# Altium project STM32_Pi_HAT.PrjPcb
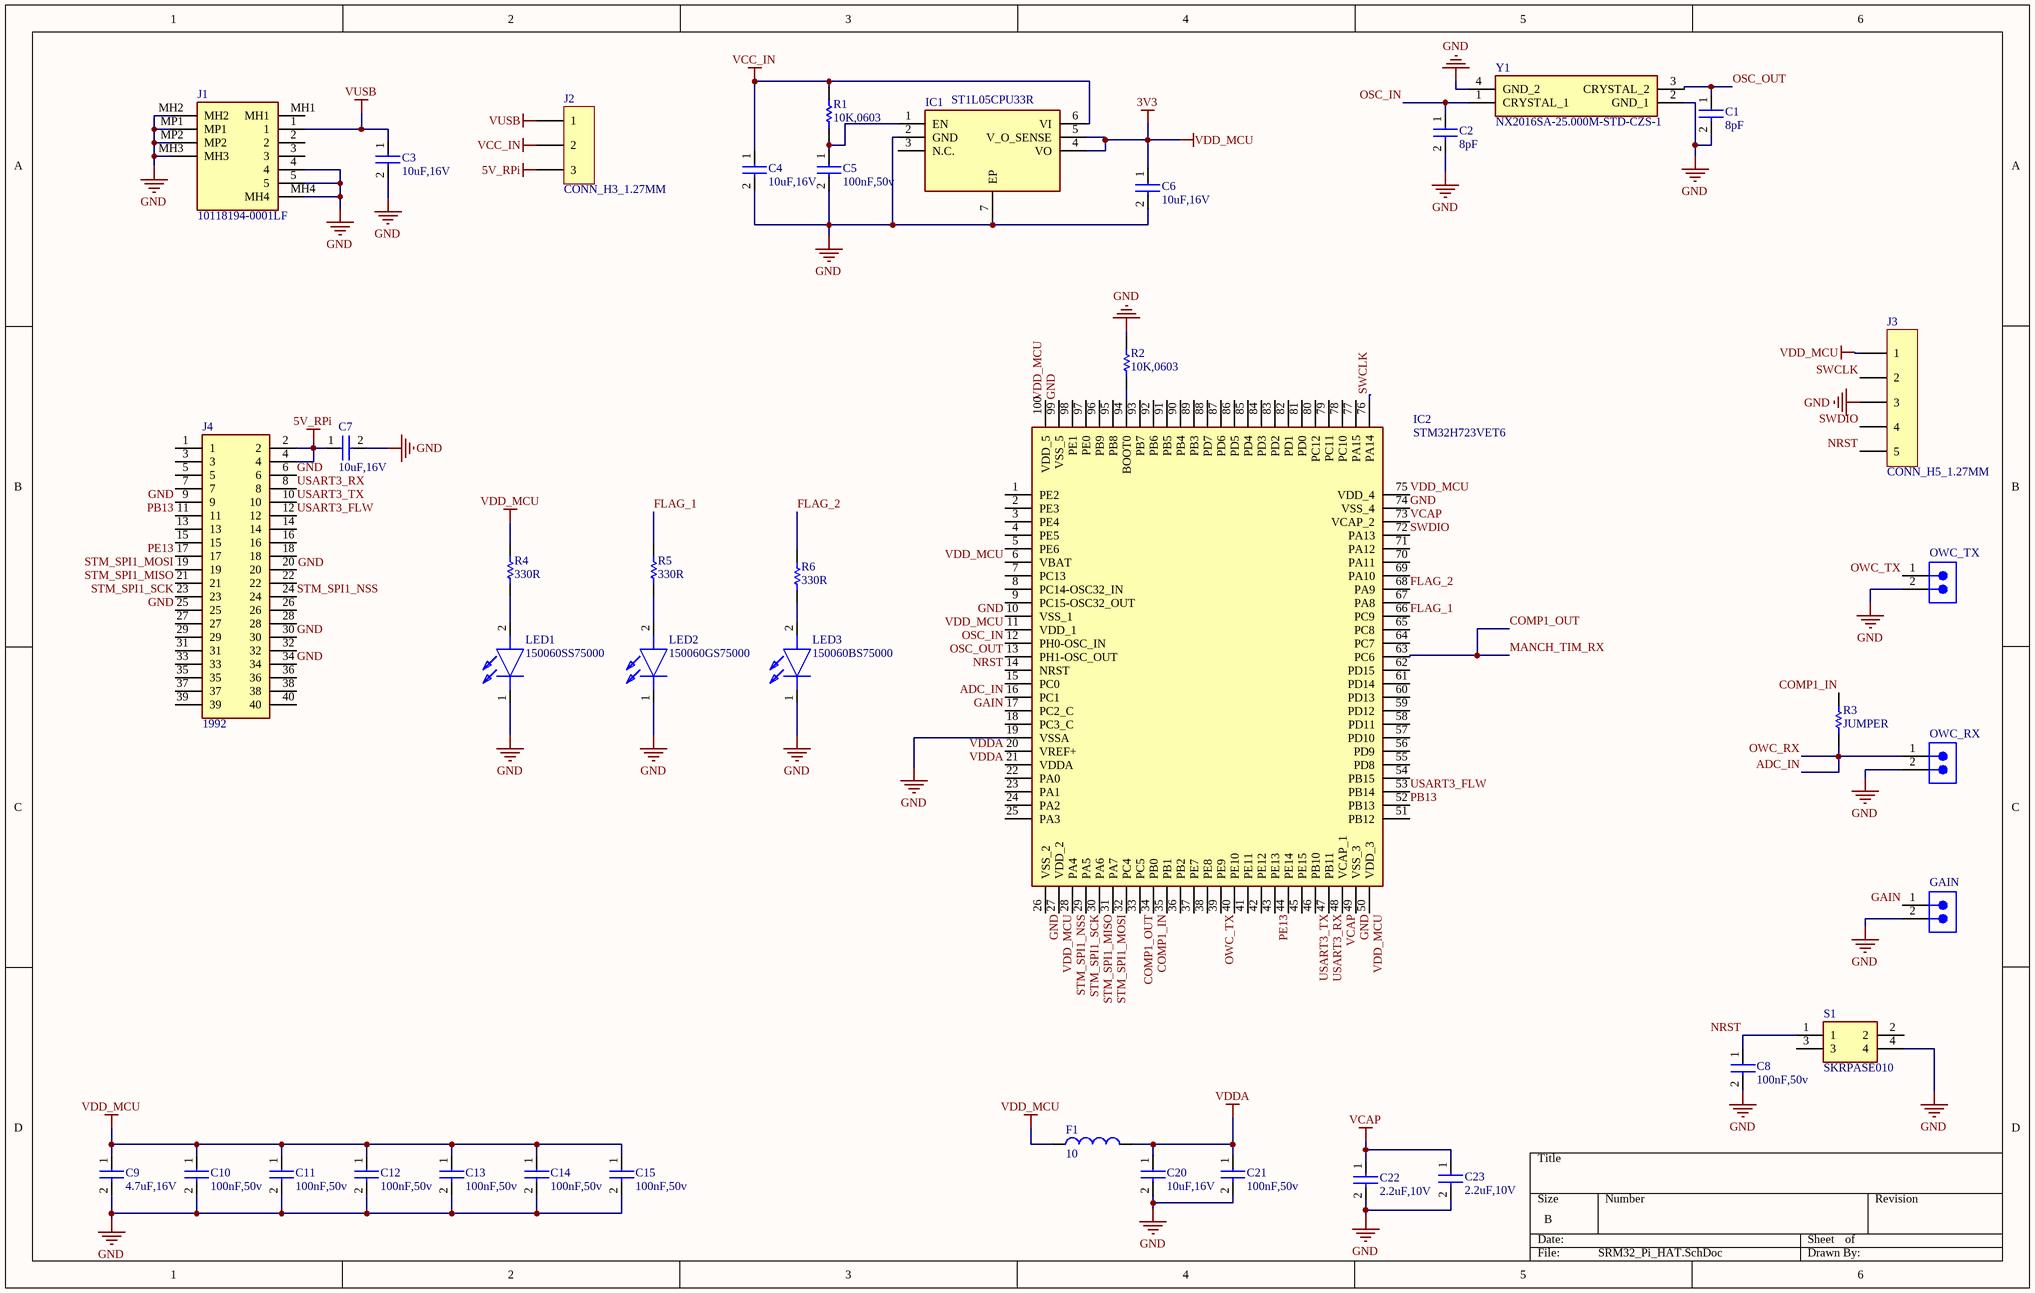
[diagram p0: SRM32_Pi_HAT.SchDoc]
1 sheet, 40 parts. Net scope: global (net labels, ports and power ports of the same name join across sheets).
Board file: STM32_Pi_HAT.PcbDoc

## Sheet SRM32_Pi_HAT.SchDoc: RPi_HAT_STM32
size B; CompanyName: IMDEA Networks; Revision: 1; SheetNumber: 1; SheetTotal: 1

### Parts
C1  8pF  [CAP0603_]
C2  8pF  [CAP0603_]
C3  10uF,16V  [CAP0603_]
C4  10uF,16V  [CAP0603_]
C5  100nF,50v  [CAP0603_]
C6  10uF,16V  [CAP0603_]
C7  10uF,16V  [CAP0603_]
C8  100nF,50v  [CAP0603_]
C9  4.7uF,16V  [CAP0603_]
C10  100nF,50v  [CAP0603_]
C11  100nF,50v  [CAP0603_]
C12  100nF,50v  [CAP0603_]
C13  100nF,50v  [CAP0603_]
C14  100nF,50v  [CAP0603_]
C15  100nF,50v  [CAP0603_]
C20  10uF,16V  [CAP0603_]
C21  100nF,50v  [CAP0603_]
C22  2.2uF,10V  [CAP0603_]
C23  2.2uF,10V  [CAP0603_]
F1  10  [IND0603_]
GAIN  61900211121  [61900211121]  (value not drawn)
IC1  ST1L05CPU33R  [SON95P300X300X100-7N-D]
IC2  STM32H723VET6  [QFP50P1600X1600X160-100N]
J1  10118194-0001LF  [101181940001LF]
J2  CONN_H3_1.27MM  [CONN_H3_1.27MM]
J3  CONN_H5_1.27MM  [CONN_H5_1.27MM]
J4  1992  [RHDR40W64P254_2X20_5130X500X1375P]
LED1  150060SS75000  [LEDC1608X80N]
LED2  150060GS75000  [LEDC1608X70N]
LED3  150060BS75000  [LEDC1608X80N]
OWC_RX  61900211121  [61900211121]  (value not drawn)
OWC_TX  61900211121  [61900211121]  (value not drawn)
R1  10K,0603  [RES0603_]
R2  10K,0603  [RES0603_]
R3  JUMPER  [RES0603_]
R4  330R  [RES0603_]
R5  330R  [RES0603_]
R6  330R  [RES0603_]
S1  SKRPASE010  [SKRPASE010]
Y1  NX2016SA-25.000M-STD-CZS-1  [NX2016SA32MEXS00ACS06465]

### Nets
5V_RPi: C7.1 J2.3 J4.2 J4.4
GND: C1.2 C2.2 C3.2 C4.2 C5.2 C6.2 C7.2 C8.2 C9.2 C10.2 C11.2 C12.2 C13.2 C14.2 C15.2 C20.2 C21.2 C22.2 C23.2 GAIN.2 IC1.2(GND) IC1.7(EP) IC2.10(VSS_1) IC2.19(VSSA) IC2.26(VSS_2) IC2.49(VSS_3) IC2.74(VSS_4) IC2.99(VSS_5) J1.4 J1.5 J1.MH2 J1.MH3 J1.MH4 J1.MP1 J1.MP2 J3.3 J4.6 J4.9 J4.25 J4.30 J4.34 LED1.1(K) LED2.1(K) LED3.1(K) OWC_RX.2 OWC_TX.2 R2.1 S1.4 Y1.2(GND_1) Y1.4(GND_2)
VCAP: C22.1 C23.1 IC2.48(VCAP_1) IC2.73(VCAP_2)
VCC_IN: C4.1 IC1.6(VI) J2.2 R1.1
VDD_MCU: C6.1 C9.1 C10.1 C11.1 C12.1 C13.1 C14.1 C15.1 F1.1 IC1.4(VO) IC1.5(V_O_SENSE) IC2.6(VBAT) IC2.11(VDD_1) IC2.27(VDD_2) IC2.50(VDD_3) IC2.75(VDD_4) IC2.100(VDD_5) J3.1 R4.1  [also labelled 3V3]
VDDA: C20.1 C21.1 F1.2 IC2.20(VREF+) IC2.21(VDDA)
VUSB: C3.1 J1.1 J2.1
ADC_IN: IC2.16(PC1) OWC_RX.1 R3.1  [also labelled OWC_RX]
COMP1_IN: IC2.34(PB0) R3.2
COMP1_OUT: IC2.33(PC5) IC2.63(PC6)  [also labelled MANCH_TIM_RX]
FLAG_1: IC2.66(PC9) R5.1
FLAG_2: IC2.68(PA9) R6.1
GAIN: GAIN.1 IC2.17(PC2_C)
NRST: C8.1 IC2.14(NRST) J3.5 S1.1
OSC_IN: C2.1 IC2.12(PH0-OSC_IN) Y1.1(CRYSTAL_1)
OSC_OUT: C1.1 IC2.13(PH1-OSC_OUT) Y1.3(CRYSTAL_2)
OWC_TX: IC2.39(PE9) OWC_TX.1
PB13: IC2.52(PB13) J4.11
PE13: IC2.43(PE13) J4.17
STM_SPI1_MISO: IC2.30(PA6) J4.21
STM_SPI1_MOSI: IC2.31(PA7) J4.19
STM_SPI1_NSS: IC2.28(PA4) J4.24
STM_SPI1_SCK: IC2.29(PA5) J4.23
SWCLK: IC2.76(PA14) J3.2
SWDIO: IC2.72(PA13) J3.4
USART3_FLW: IC2.53(PB14) J4.12
USART3_RX: IC2.47(PB11) J4.8
USART3_TX: IC2.46(PB10) J4.10
NetC5_1: C5.1 IC1.1(EN) R1.2
NetIC2_94: IC2.94(BOOT0) R2.2
NetLED1_2: LED1.2(A) R4.2
NetLED2_2: LED2.2(A) R5.2
NetLED3_2: LED3.2(A) R6.2

Not connected (* = marked no-connect by the designer): IC1 3(N.C.); IC2 1(PE2) 2(PE3) 3(PE4) 4(PE5) 5(PE6) 7(PC13) 8(PC14-OSC32_IN) 9(PC15-OSC32_OUT) 15(PC0) 18(PC3_C) 22(PA0) 23(PA1) 24(PA2) 25(PA3) 32(PC4) 35(PB1) 36(PB2) 37(PE7) 38(PE8) 40(PE10) 41(PE11) 42(PE12) 44(PE14) 45(PE15) 51(PB12) 54(PB15) 55(PD8) 56(PD9) 57(PD10) 58(PD11) 59(PD12) 60(PD13) 61(PD14) 62(PD15) 64(PC7) 65(PC8) 67(PA8) 69(PA10) 70(PA11) 71(PA12) 77(PA15) 78(PC10) 79(PC11) 80(PC12) 81(PD0) 82(PD1) 83(PD2) 84(PD3) 85(PD4) 86(PD5) 87(PD6) 88(PD7) 89(PB3) 90(PB4) 91(PB5) 92(PB6) 93(PB7) 95(PB8) 96(PB9) 97(PE0) 98(PE1); J1 2 3 MH1; J4 1 3 5 7 13 14 15 16 18 20 22 26 27 28 29 31 32 33 35 36 37 38 39 40; S1 2 3

### Notes on the sheet
- Labels drawn without touching a wire or pin: GND

### Library data of the parts
C1 C2 = C0603-4.7pF-100v: Multilayer Ceramic Capacitors MLCC - SMD/SMT WCAP-CSGP 100V 4.7pF 0603 .25pFTol; Fabricant: WURTH; Fournisseur: Mouser; Ref Fabricant: 885012006091; Ref Fournisseur: 710-885012006091; Unit Price(100): 0.053; Help URL: *; Unit Price: 0.13
C3 C4 C6 C7 C20 = C0603-10uF-16v: SMD/SMT 10uF 0603 10% 16V MLCC; Fabricant: Murata Electronics; Fournisseur: Mouser; Ref Fabricant: GRM188R61C106KALJ; Ref Fournisseur: 81-GRM188R61C106KALJ; Unit Price(100): 0.233; Help URL: https://www.mouser.mx/datasheet/2/281/murata_03052018_GRM_Series_1-1310166.pdf; Unit Price: 0.559
C5 C8 C10-C15 C21 = C0603-100nF-50V-X7R: Capacitor, Ceramic, 10nF, 50V, 20%, X7R, 0603; Ref Fabricant: C0603MRY5V9BB104; Ref Fournisseur: 603-C0603MRY5V9BB104; Fournisseur: Mouser; Fabricant: YAGEO; Unit Price(100): 0.03; Help URL: *; Unit Price: 0.13
C9 = C0603-4.7uF-16V-X5R: Multilayer Ceramic Capacitors MLCC - SMD/SMT 0603 16VDC 4.7uF 20% X5R; Ref Fabricant: EMK107ABJ475MA-T; Ref Fournisseur: 963-EMK107ABJ475MA-T; Fournisseur: Mouser; Fabricant: Taiyo Yuden; Unit Price(100): 0.109; Help URL: *; Unit Price: 0.364
C22 C23 = C0603-2.2uF-10V-X5R: Multilayer Ceramic Capacitors MLCC - SMD/SMT WCAP-CSGP 2.2uF 0603 20% 10V MLCC; Fabricant: Wurth Electronics; Fournisseur: Mouser; Ref Fournisseur: 710-885012106011; Ref Fabricant: 885012106011; Unit Price(100): 0.182; Help URL: *; Unit Price: 0.208
F1 = MH1608-100Y: Ferrite Beads 10 ohms 25% HIGH CURRENT 6A; Fabricant: Bourns; Fournisseur: MOUSER; Ref Fournisseur: 652-MH1608-100Y; Unit Price(100): 0.027; Help URL: https://www.mouser.mx/datasheet/2/54/mh-777565.pdf; Ref Fabricant: MH1608-100Y; Unit Price: 0.13
GAIN OWC_RX OWC_TX = CMP-1502-00584-3: NexarPartId: 18818218; Gender: Male; Connector Type: Male Pin; Insulation Resistance: 1GΩ; Contact Resistance: 20mΩ; Number of Contacts: 2; Operating Supply Voltage: 250V; Current Rating: 3A; Pitch: 2.54mm; Color: Beige; Fastening Type: Friction; Number of Pins: 2; Lead Pitch: 2.54mm; Orientation: Vertical; Max Operating Temperature: 105°C; Contact Mating Length: 7.493mm; RoHS: Compliant; Voltage Rating: 250V; Number of Positions: 2; Mount: Through Hole; Length: 5.08mm; Contact Plating: Tin; Width: 5.12mm; Termination: Through Hole; Flammability Rating: UL94 V-0; Min Operating Temperature: -40°C; Housing Material: Nylon; Contact Gender: Male; Number of Rows: 1; Packaging: Bulk; REACH SVHC: Unknown; Contact Material: Copper; Height: 11.75mm
IC1 = ST1L05CPU33R: Integrated Circuit; Manufacturer_Name: STMicroelectronics; Datasheet Link: https://www.st.com/resource/en/datasheet/st1l05.pdf; Height: 1mm; Manufacturer_Part_Number: ST1L05CPU33R; Mouser Part Number: 511-ST1L05CPU33R; Mouser Price/Stock: https://www.mouser.co.uk/ProductDetail/STMicroelectronics/ST1L05CPU33R?qs=J6yVZnuyYCM7Ijtp87hQ4A%3D%3D; Arrow Part Number: ST1L05CPU33R; Arrow Price/Stock: https://www.arrow.com/en/products/st1l05cpu33r/stmicroelectronics?utm_currency=USD&region=nac
IC2 = CMP-005-000001-1: Integrated Circuit; Manufacturer_Name: STMicroelectronics; Source: SamacSys.SchLib; Manufacturer_Part_Number: STM32H723VET6; Design Item ID: STM32H723VET6; Arrow Price/Stock: https://www.arrow.com/en/products/stm32h723vet6/stmicroelectronics?utm_currency=USD&region=nac; Arrow Part Number: STM32H723VET6; Datasheet Link: https://www.st.com/resource/en/datasheet/stm32h723zg.pdf; Mouser Price/Stock: https://www.mouser.co.uk/ProductDetail/STMicroelectronics/STM32H723VET6?qs=sPbYRqrBIVnD9Udgf5csJA%3D%3D; Height: 1.6mm; Mouser Part Number: 511-STM32H723VET6
J1 = 10118194-0001LF: Connector; Manufacturer_Name: Amphenol Communications Solutions; Datasheet Link: https://www.amphenol-cs.com/micro-usb-101181940001lf.html; Height: 3.25mm; Manufacturer_Part_Number: 10118194-0001LF; Arrow Part Number: 10118194-0001LF; Arrow Price/Stock: https://www.arrow.com/en/products/10118194-0001lf/amphenol-fci?utm_currency=USD&region=nac
J2 = CONN_H3_1.27MM: Fabricant: Harwin; Fournisseur: Mouser; Ref Fabricant: M50-3530342; Ref Fournisseur: 855-M50-3530342; Unit Price(100): 0.088; Help URL: https://www.mouser.mx/datasheet/2/181/M50-353-1100851.pdf; Unit Price: 0.182
J3 = CONN_H5_1.27MM: Fabricant: Samtec; Fournisseur: Mouser; Ref Fabricant: TMS10560GS; Ref Fournisseur: 200-TMS10560GS; Unit Price(: 1.78; Unit Price(100): 1.09; Help URL: https://www.mouser.mx/datasheet/2/527/tms_th-1370533.pdf
J4 = 1992: Connector; Manufacturer_Name: Adafruit; Datasheet Link: https://cdn-shop.adafruit.com/datasheets/1992_datasheet2.pdf; Height: 13.75mm; Manufacturer_Part_Number: 1992; Mouser Part Number: 485-1992; Mouser Price/Stock: https://www.mouser.co.uk/ProductDetail/Adafruit/1992?qs=GURawfaeGuBPldm8Estq5w%3D%3D; Arrow Part Number: 1992; Arrow Price/Stock: https://www.arrow.com/en/products/1992/adafruit-industries?utm_currency=USD&region=nac
LED1 = 150060SS75000: LED; Manufacturer_Name: Wurth Elektronik; Datasheet Link: https://www.we-online.com/catalog/datasheet/150060SS75000.pdf; Height: 0.8mm; Manufacturer_Part_Number: 150060SS75000; Mouser Part Number: 710-150060SS75000; Mouser Price/Stock: https://www.mouser.co.uk/ProductDetail/Wurth-Elektronik/150060SS75000?qs=LlUlMxKIyB0oQaxwspeTEA%3D%3D
LED2 = 150060GS75000: LED; Manufacturer_Name: Wurth Elektronik; Datasheet Link: https://www.we-online.com/catalog/datasheet/150060GS75000.pdf; Height: 0.7mm; Manufacturer_Part_Number: 150060GS75000; Mouser Part Number: 710-150060GS75000; Mouser Price/Stock: https://www.mouser.co.uk/ProductDetail/Wurth-Elektronik/150060GS75000?qs=LlUlMxKIyB0UYkq5lDO8nA%3D%3D
LED3 = 150060BS75000: LED; Manufacturer_Name: Wurth Elektronik; Datasheet Link: https://www.we-online.com/catalog/datasheet/150060BS75000.pdf; Height: 0.8mm; Manufacturer_Part_Number: 150060BS75000; Mouser Part Number: 710-150060BS75000; Mouser Price/Stock: https://www.mouser.co.uk/ProductDetail/Wurth-Elektronik/150060BS75000?qs=LlUlMxKIyB2DLLpXQThavA%3D%3D
R1 R2 = R0603-10K-1/10W-1%: Thick Film Resistors - SMD 10K OHM 1% 0603; Ref Fabricant: RC0603FR-0710KL; Ref Fournisseur: 603-RC0603FR-0710KL; Fournisseur: Mouser; Fabricant: Yageo; Unit Price(100): 0.008; Help URL: *; Unit Price: 0.13
R3 = R0603-0R-1/10W-5%: Resistor, ThinFilm, 0R, 5%, 1/8W, 0603; Ref Fabricant: SFR03EZPJ000; Ref Fournisseur: 755-SFR03EZPJ000; Fournisseur: Mouser; Fabricant: Yageo; Unit Price(100): 0.03; Help URL: *; Unit Price: 0.13
R4-R6 = R0603-330R-1/10W-1%_1: Thick Film Resistors - SMD 330Ohmns 1/10W 0603 5%; Ref Fabricant: AR0603JR-07330RL; Ref Fournisseur: 603-AR0603JR-07330RL; Fournisseur: Mouser; Fabricant: YAGEO; Unit Price(100): 0.137; Help URL: https://www.mouser.mx/ProductDetail/YAGEO/AR0603JR-07330RL?qs=tggtontpCXOcsXkekzf4sA%3D%3D; Unit Price: 0.403
S1 = SKRPASE010: Switch; Manufacturer_Name: ALPS Electric; Datasheet Link: https://www.mouser.ca/ProductDetail/ALPS/SKRPASE010?qs=byeeYqUIh0NdKk8WD590Nw%3D%3D; Height: 2.5mm; Manufacturer_Part_Number: SKRPASE010; Mouser Part Number: 688-SKRPASE010; Mouser Price/Stock: https://www.mouser.co.uk/ProductDetail/Alps-Alpine/SKRPASE010?qs=byeeYqUIh0NdKk8WD590Nw%3D%3D
Y1 = NX2016SA-25.000M-STD-CZS-1: Crystal or Oscillator; Manufacturer_Name: NDK; Datasheet Link: https://datasheet.datasheetarchive.com/originals/distributors/DKDS-17/332064.pdf; Manufacturer_Part_Number: NX2016SA-25.000M-STD-CZS-1; Mouser Part Number: 344-NX2016SA25MSTZS1; Mouser Price/Stock: https://www.mouser.co.uk/ProductDetail/NDK/NX2016SA-25.000M-STD-CZS-1?qs=w%2Fv1CP2dgqozB742%252BoULZA%3D%3D